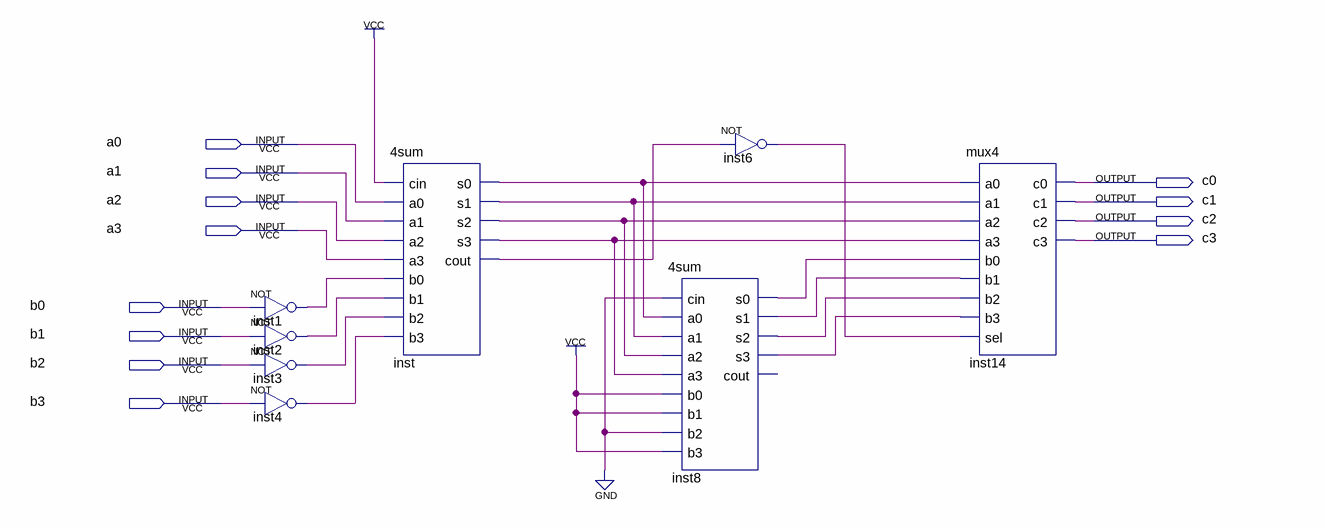
[diagram p0: schematic sheet]
// Quartus schematic diff11.bdf as structural Verilog: 8 symbols, 12 pins
module diff11 (
  input  a0,
  input  a1,
  input  a2,
  input  a3,
  input  b0,
  input  b1,
  input  b2,
  input  b3,
  output c0,
  output c1,
  output c2,
  output c3
);

  wire inst1_out, inst2_out, inst3_out, inst4_out, inst6_out, inst8_s0, inst8_s1, inst8_s2, inst8_s3,
       inst_cout, inst_s0, inst_s1, inst_s2, inst_s3;

  not inst1 (inst1_out, b0);
  not inst2 (inst2_out, b1);
  not inst3 (inst3_out, b2);
  not inst4 (inst4_out, b3);
  \4sum  inst (
    .cin(1'b1), .a0(a0), .a1(a1), .a2(a2), .a3(a3), .b0(inst1_out), .b1(inst2_out), .b2(inst3_out),
    .b3(inst4_out), .s0(inst_s0), .s1(inst_s1), .s2(inst_s2), .s3(inst_s3), .cout(inst_cout));
  \4sum  inst8 (
    .cin(1'b0), .a0(inst_s0), .a1(inst_s1), .a2(inst_s2), .a3(inst_s3), .b0(1'b1), .b1(1'b1), .b2(1'b0),
    .b3(1'b1), .s0(inst8_s0), .s1(inst8_s1), .s2(inst8_s2), .s3(inst8_s3));  // open: cout
  not inst6 (inst6_out, inst_cout);
  mux4 inst14 (
    .a0(inst_s0), .a1(inst_s1), .a2(inst_s2), .a3(inst_s3), .b0(inst8_s0), .b1(inst8_s1), .b2(inst8_s2),
    .b3(inst8_s3), .sel(inst6_out), .c0(c0), .c1(c1), .c2(c2), .c3(c3));
endmodule
